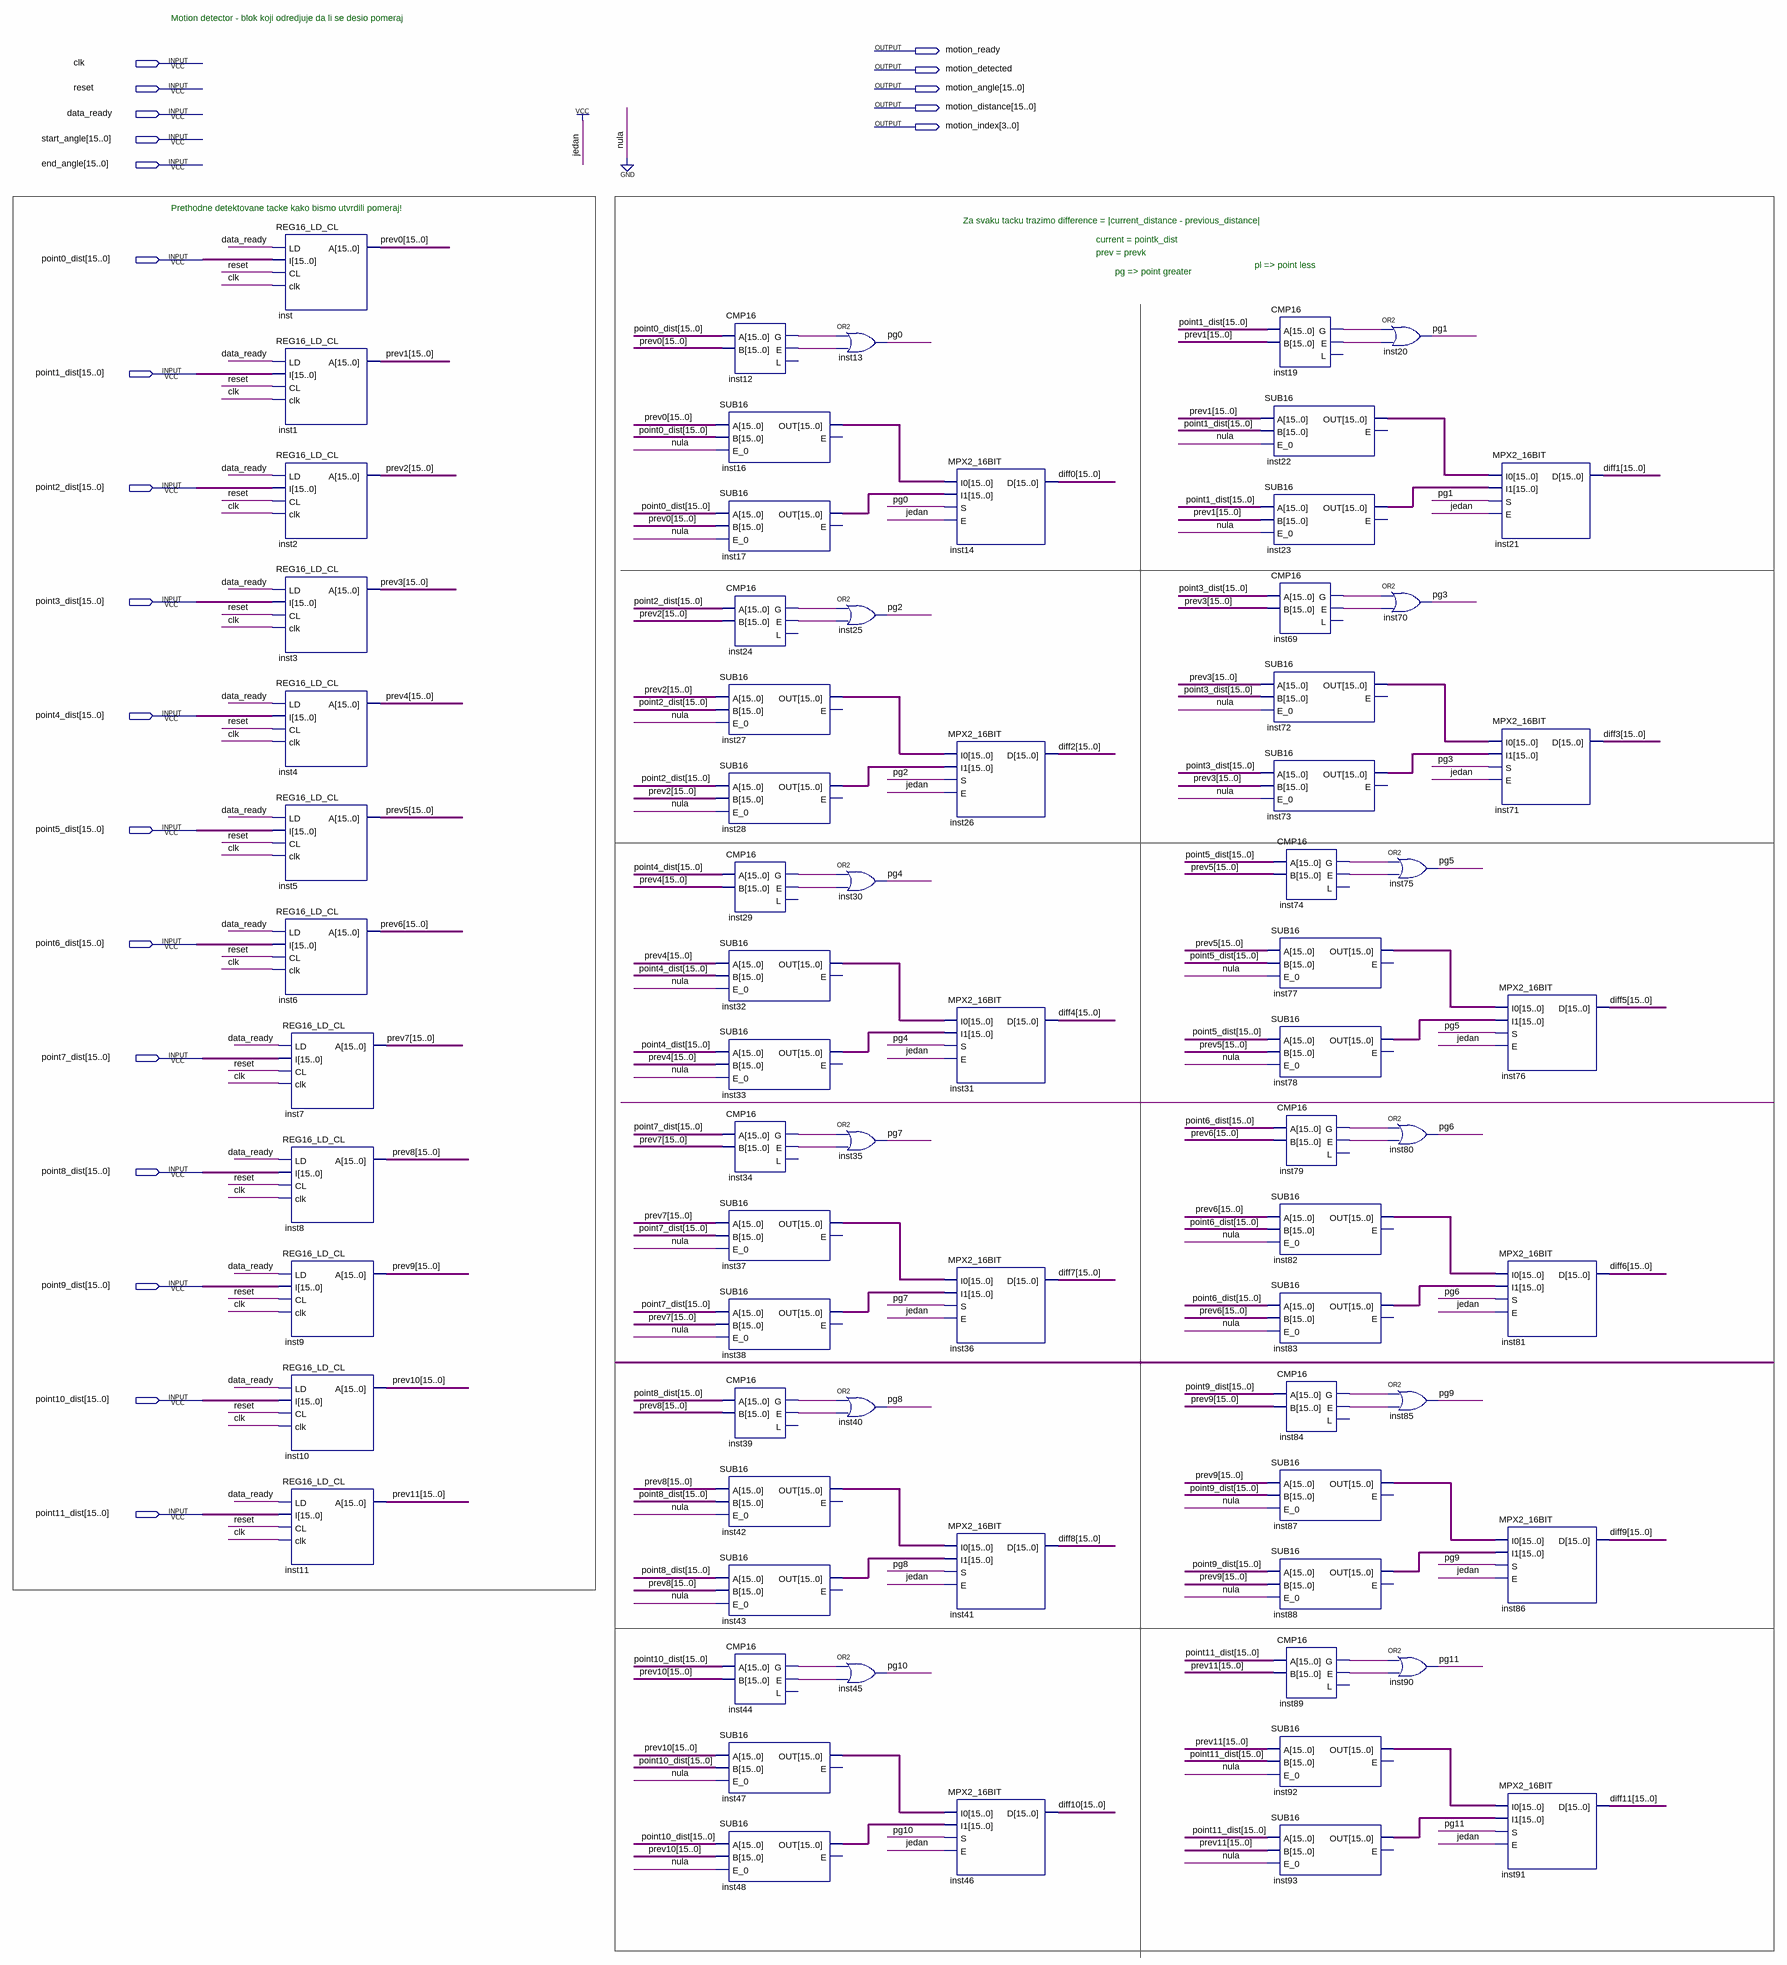
[diagram p0: schematic sheet]
// Quartus schematic MotionDetector.bdf as structural Verilog: 72 symbols, 22 pins
module MotionDetector (
  input  clk,
  input  reset,
  input  data_ready,
  input  [15:0] start_angle,
  input  [15:0] end_angle,
  input  [15:0] point0_dist,
  input  [15:0] point1_dist,
  input  [15:0] point2_dist,
  input  [15:0] point3_dist,
  input  [15:0] point4_dist,
  input  [15:0] point5_dist,
  input  [15:0] point6_dist,
  input  [15:0] point7_dist,
  input  [15:0] point8_dist,
  input  [15:0] point9_dist,
  input  [15:0] point10_dist,
  input  [15:0] point11_dist,
  output motion_ready,
  output motion_detected,
  output [15:0] motion_angle,
  output [15:0] motion_distance,
  output [3:0] motion_index
);

  wire inst12_e, inst12_g, inst19_e, inst19_g, inst24_e, inst24_g, inst29_e, inst29_g, inst34_e, inst34_g,
       inst39_e, inst39_g, inst44_e, inst44_g, inst69_e, inst69_g, inst74_e, inst74_g, inst79_e, inst79_g,
       inst84_e, inst84_g, inst89_e, inst89_g, pg0, pg1, pg2, pg3, pg4, pg5, pg6, pg7, pg8, pg9, pg10, pg11;
  wire [15:0] diff0, diff1, diff2, diff3, diff4, diff5, diff6, diff7, diff8, diff9, diff10, diff11,
       inst16_out, inst17_out, inst22_out, inst23_out, inst27_out, inst28_out, inst32_out, inst33_out,
       inst37_out, inst38_out, inst42_out, inst43_out, inst47_out, inst48_out, inst72_out, inst73_out,
       inst77_out, inst78_out, inst82_out, inst83_out, inst87_out, inst88_out, inst92_out, inst93_out, prev0,
       prev1, prev2, prev3, prev4, prev5, prev6, prev7, prev8, prev9, prev10, prev11;

  REG16_LD_CL inst (.LD(data_ready), .I(point0_dist), .CL(reset), .clk(clk), .A(prev0));
  REG16_LD_CL inst1 (.LD(data_ready), .I(point1_dist), .CL(reset), .clk(clk), .A(prev1));
  REG16_LD_CL inst2 (.LD(data_ready), .I(point2_dist), .CL(reset), .clk(clk), .A(prev2));
  REG16_LD_CL inst3 (.LD(data_ready), .I(point3_dist), .CL(reset), .clk(clk), .A(prev3));
  REG16_LD_CL inst4 (.LD(data_ready), .I(point4_dist), .CL(reset), .clk(clk), .A(prev4));
  REG16_LD_CL inst5 (.LD(data_ready), .I(point5_dist), .CL(reset), .clk(clk), .A(prev5));
  REG16_LD_CL inst6 (.LD(data_ready), .I(point6_dist), .CL(reset), .clk(clk), .A(prev6));
  REG16_LD_CL inst7 (.LD(data_ready), .I(point7_dist), .CL(reset), .clk(clk), .A(prev7));
  REG16_LD_CL inst8 (.LD(data_ready), .I(point8_dist), .CL(reset), .clk(clk), .A(prev8));
  REG16_LD_CL inst9 (.LD(data_ready), .I(point9_dist), .CL(reset), .clk(clk), .A(prev9));
  REG16_LD_CL inst10 (.LD(data_ready), .I(point10_dist), .CL(reset), .clk(clk), .A(prev10));
  REG16_LD_CL inst11 (.LD(data_ready), .I(point11_dist), .CL(reset), .clk(clk), .A(prev11));
  SUB16 inst16 (.A(prev0), .B(point0_dist), .E_0(1'b0), .OUT(inst16_out));  // open: E
  SUB16 inst17 (.A(point0_dist), .B(prev0), .E_0(1'b0), .OUT(inst17_out));  // open: E
  SUB16 inst27 (.A(prev2), .B(point2_dist), .E_0(1'b0), .OUT(inst27_out));  // open: E
  SUB16 inst28 (.A(point2_dist), .B(prev2), .E_0(1'b0), .OUT(inst28_out));  // open: E
  SUB16 inst32 (.A(prev4), .B(point4_dist), .E_0(1'b0), .OUT(inst32_out));  // open: E
  SUB16 inst33 (.A(point4_dist), .B(prev4), .E_0(1'b0), .OUT(inst33_out));  // open: E
  SUB16 inst37 (.A(prev7), .B(point7_dist), .E_0(1'b0), .OUT(inst37_out));  // open: E
  SUB16 inst38 (.A(point7_dist), .B(prev7), .E_0(1'b0), .OUT(inst38_out));  // open: E
  SUB16 inst42 (.A(prev8), .B(point8_dist), .E_0(1'b0), .OUT(inst42_out));  // open: E
  SUB16 inst43 (.A(point8_dist), .B(prev8), .E_0(1'b0), .OUT(inst43_out));  // open: E
  SUB16 inst47 (.A(prev10), .B(point10_dist), .E_0(1'b0), .OUT(inst47_out));  // open: E
  SUB16 inst48 (.A(point10_dist), .B(prev10), .E_0(1'b0), .OUT(inst48_out));  // open: E
  CMP16 inst12 (.A(point0_dist), .B(prev0), .G(inst12_g), .E(inst12_e));  // open: L
  CMP16 inst24 (.A(point2_dist), .B(prev2), .G(inst24_g), .E(inst24_e));  // open: L
  CMP16 inst29 (.A(point4_dist), .B(prev4), .G(inst29_g), .E(inst29_e));  // open: L
  CMP16 inst34 (.A(point7_dist), .B(prev7), .G(inst34_g), .E(inst34_e));  // open: L
  CMP16 inst39 (.A(point8_dist), .B(prev8), .G(inst39_g), .E(inst39_e));  // open: L
  CMP16 inst44 (.A(point10_dist), .B(prev10), .G(inst44_g), .E(inst44_e));  // open: L
  or inst13 (pg0, inst12_g, inst12_e);
  or inst25 (pg2, inst24_g, inst24_e);
  or inst30 (pg4, inst29_g, inst29_e);
  or inst35 (pg7, inst34_g, inst34_e);
  or inst40 (pg8, inst39_g, inst39_e);
  or inst45 (pg10, inst44_g, inst44_e);
  MPX2_16BIT inst14 (.I0(inst16_out), .I1(inst17_out), .S(pg0), .E(1'b1), .D(diff0));
  MPX2_16BIT inst26 (.I0(inst27_out), .I1(inst28_out), .S(pg2), .E(1'b1), .D(diff2));
  MPX2_16BIT inst31 (.I0(inst32_out), .I1(inst33_out), .S(pg4), .E(1'b1), .D(diff4));
  MPX2_16BIT inst36 (.I0(inst37_out), .I1(inst38_out), .S(pg7), .E(1'b1), .D(diff7));
  MPX2_16BIT inst41 (.I0(inst42_out), .I1(inst43_out), .S(pg8), .E(1'b1), .D(diff8));
  MPX2_16BIT inst46 (.I0(inst47_out), .I1(inst48_out), .S(pg10), .E(1'b1), .D(diff10));
  CMP16 inst19 (.A(point1_dist), .B(prev1), .G(inst19_g), .E(inst19_e));  // open: L
  SUB16 inst22 (.A(prev1), .B(point1_dist), .E_0(1'b0), .OUT(inst22_out));  // open: E
  SUB16 inst23 (.A(point1_dist), .B(prev1), .E_0(1'b0), .OUT(inst23_out));  // open: E
  CMP16 inst69 (.A(point3_dist), .B(prev3), .G(inst69_g), .E(inst69_e));  // open: L
  SUB16 inst72 (.A(prev3), .B(point3_dist), .E_0(1'b0), .OUT(inst72_out));  // open: E
  SUB16 inst73 (.A(point3_dist), .B(prev3), .E_0(1'b0), .OUT(inst73_out));  // open: E
  CMP16 inst74 (.A(point5_dist), .B(prev5), .G(inst74_g), .E(inst74_e));  // open: L
  SUB16 inst77 (.A(prev5), .B(point5_dist), .E_0(1'b0), .OUT(inst77_out));  // open: E
  SUB16 inst78 (.A(point5_dist), .B(prev5), .E_0(1'b0), .OUT(inst78_out));  // open: E
  CMP16 inst79 (.A(point6_dist), .B(prev6), .G(inst79_g), .E(inst79_e));  // open: L
  SUB16 inst82 (.A(prev6), .B(point6_dist), .E_0(1'b0), .OUT(inst82_out));  // open: E
  SUB16 inst83 (.A(point6_dist), .B(prev6), .E_0(1'b0), .OUT(inst83_out));  // open: E
  CMP16 inst84 (.A(point9_dist), .B(prev9), .G(inst84_g), .E(inst84_e));  // open: L
  SUB16 inst87 (.A(prev9), .B(point9_dist), .E_0(1'b0), .OUT(inst87_out));  // open: E
  SUB16 inst88 (.A(point9_dist), .B(prev9), .E_0(1'b0), .OUT(inst88_out));  // open: E
  CMP16 inst89 (.A(point11_dist), .B(prev11), .G(inst89_g), .E(inst89_e));  // open: L
  SUB16 inst92 (.A(prev11), .B(point11_dist), .E_0(1'b0), .OUT(inst92_out));  // open: E
  SUB16 inst93 (.A(point11_dist), .B(prev11), .E_0(1'b0), .OUT(inst93_out));  // open: E
  or inst20 (pg1, inst19_g, inst19_e);
  or inst70 (pg3, inst69_g, inst69_e);
  or inst75 (pg5, inst74_g, inst74_e);
  or inst80 (pg6, inst79_g, inst79_e);
  or inst85 (pg9, inst84_g, inst84_e);
  or inst90 (pg11, inst89_g, inst89_e);
  MPX2_16BIT inst21 (.I0(inst22_out), .I1(inst23_out), .S(pg1), .E(1'b1), .D(diff1));
  MPX2_16BIT inst71 (.I0(inst72_out), .I1(inst73_out), .S(pg3), .E(1'b1), .D(diff3));
  MPX2_16BIT inst76 (.I0(inst77_out), .I1(inst78_out), .S(pg5), .E(1'b1), .D(diff5));
  MPX2_16BIT inst81 (.I0(inst82_out), .I1(inst83_out), .S(pg6), .E(1'b1), .D(diff6));
  MPX2_16BIT inst86 (.I0(inst87_out), .I1(inst88_out), .S(pg9), .E(1'b1), .D(diff9));
  MPX2_16BIT inst91 (.I0(inst92_out), .I1(inst93_out), .S(pg11), .E(1'b1), .D(diff11));

  // Notes on the sheet:
  //   Motion detector - blok koji odredjuje da li se desio pomeraj
  //   Prethodne detektovane tacke kako bismo utvrdili pomeraj!
  //   Za svaku tacku trazimo difference = |current_distance - previous_distance|
  //   current = pointk_dist
  //   prev = prevk
  //   pl => point less
  //   pg => point greater
endmodule
